# Altium schematic sheet Module_Wifi.SchDoc
size A4
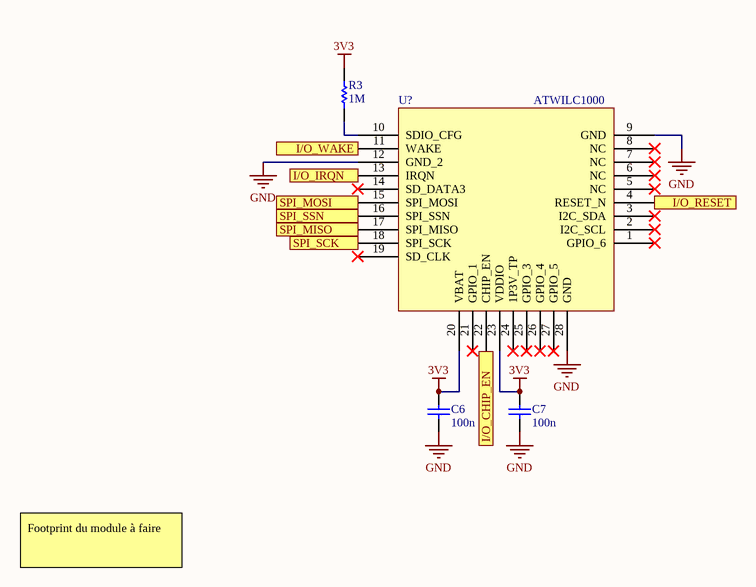
[diagram p0: Module_Wifi.SchDoc]

## Parts
C6  100n  [CAPC0805(2012)155_L]
C7  100n  [CAPC0805(2012)155_L]
R3  1M  [RESC0805(2012)_N]
U?  ATWILC1000

## Ports
I/O_CHIP_EN, I/O_IRQN, I/O_RESET, I/O_WAKE, SPI_MISO, SPI_MOSI, SPI_SCK, SPI_SSN

## Nets
3V3: C6.2 C7.2 R3.2 U?.20(VBAT) U?.23(VDDIO)
GND: C6.1 C7.1 U?.9(GND) U?.12(GND_2) U?.28(GND)
I/O_CHIP_EN: U?.22(CHIP_EN) ; port I/O_CHIP_EN
I/O_IRQN: U?.13(IRQN) ; port I/O_IRQN
I/O_RESET: U?.4(RESET_N) ; port I/O_RESET
I/O_WAKE: U?.11(WAKE) ; port I/O_WAKE
SPI_MISO: U?.17(SPI_MISO) ; port SPI_MISO
SPI_MOSI: U?.15(SPI_MOSI) ; port SPI_MOSI
SPI_SCK: U?.18(SPI_SCK) ; port SPI_SCK
SPI_SSN: U?.16(SPI_SSN) ; port SPI_SSN
NetR3_1: R3.1 U?.10(SDIO_CFG)

Not connected (* = marked no-connect by the designer): U? 1(GPIO_6)* 2(I2C_SCL)* 3(I2C_SDA)* 5(NC)* 6(NC)* 7(NC)* 8(NC)* 14(SD_DATA3)* 19(SD_CLK)* 21(GPIO_1)* 24(1P3V_TP)* 25(GPIO_3)* 26(GPIO_4)* 27(GPIO_5)*

## Notes on the sheet
- Footprint du module à faire

## Library data of the parts
C6 C7 = Capa: Case-EIA: 0805; Rated Voltage: 10 V; Value: 4.7uF; Tolerance: Â±10%; Case-Metric: 2012; Max Thickness: 1.55 mm; Technology: SMT
R3 = Resistor: Value: 1000000.00 Ohm; Case-Metric: 2012; Case-EIA: 0805; Power: 0.125 W; Tolerance: 1 %; Technology: SMT